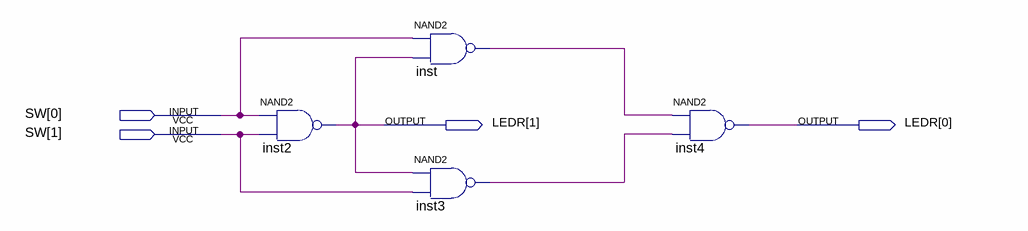
[diagram p0: schematic sheet]
// Quartus schematic half_adder.bdf as structural Verilog: 4 symbols, 4 pins
module half_adder (
  input  [1:0] SW,
  output [1:0] LEDR
);

  wire inst3_out, inst_out;

  nand inst2 (LEDR[1], SW[0], SW[1]);
  nand inst (inst_out, SW[0], LEDR[1]);
  nand inst3 (inst3_out, LEDR[1], SW[1]);
  nand inst4 (LEDR[0], inst_out, inst3_out);
endmodule
